# EAGLE design Servo-Steuer-Schaltung (EAGLE 6.2)
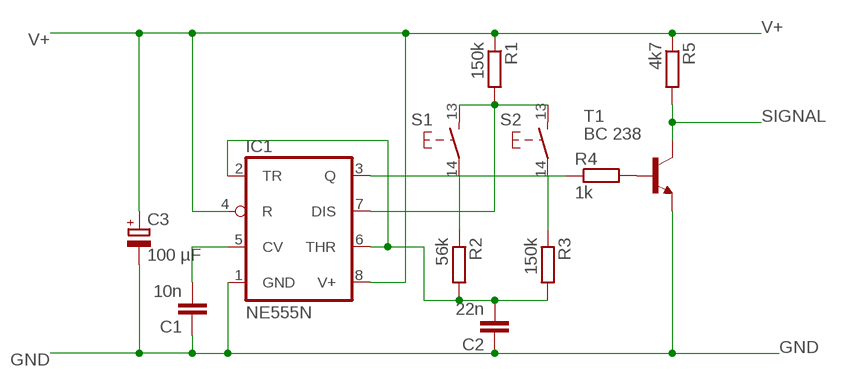
[diagram p0: schematic, sheet 1]

## Parts
C1  10n  C10/4  [C10B4]
C2  22n  C10/4  [C10B4]
C3  100 µF  CPOL-EUE2.5-7  [E2,5-7]
IC1  NE555N  [DIL08]
R1  150k  R-EU_0207/10  [0207/10]
R2  56k  R-EU_0207/10  [0207/10]
R3  150k  R-EU_0207/10  [0207/10]
R4  1k  R-EU_0207/10  [0207/10]
R5  4k7  R-EU_0207/10  [0207/10]
S1  TASTER_SCHLIESSER  [EINTASTER]
S2  TASTER_SCHLIESSER  [EINTASTER]
T1  BC 238  BC547A-NPN-TO92-CBE  [TO92-CBE]

## Nets
GND: C1.1 C2.1 C3.- IC1.1(GND) T1.E
N$1: IC1.3(Q) R4.1
N$2: R2.1 S1.14
N$3: R3.1 S2.14
N$4: C2.2 IC1.2(TR) IC1.6(THR) R2.2 R3.2
N$5: IC1.7(DIS) R1.2 S1.13 S2.13
N$6: R4.2 T1.B
N$7: C1.2 IC1.5(CV)
SIGNAL: R5.2 T1.C
V+: C3.+ IC1.4(R) IC1.8(V+) R1.1 R5.1

## Library data of the parts
C1 C2 = capacitor-wima:C: CAPACITOR naming: grid - package width
C3 = rcl:CPOL-EU: POLARIZED CAPACITOR, European symbol
IC1 = linear:*555: TIMER
R1-R5 = rcl:R-EU_: RESISTOR, European symbol
S1 S2 = e-schalter:TASTER_SCHLIESSER: Ein-Taster (Arbeitskontakt)
T1 = transistor:*-NPN-: NPN Transistror BF959 corrected 2008.03.06

## Board
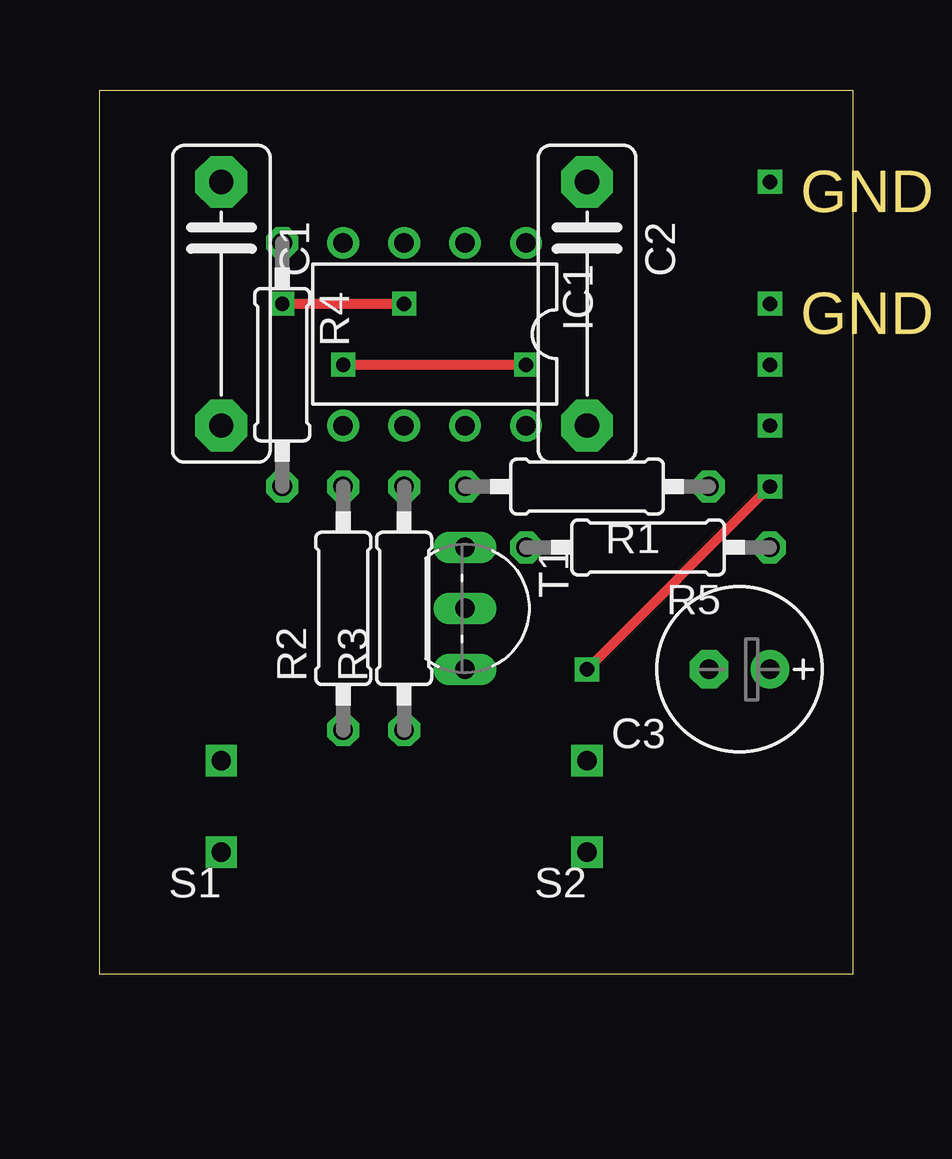
[diagram p1: board, top side]
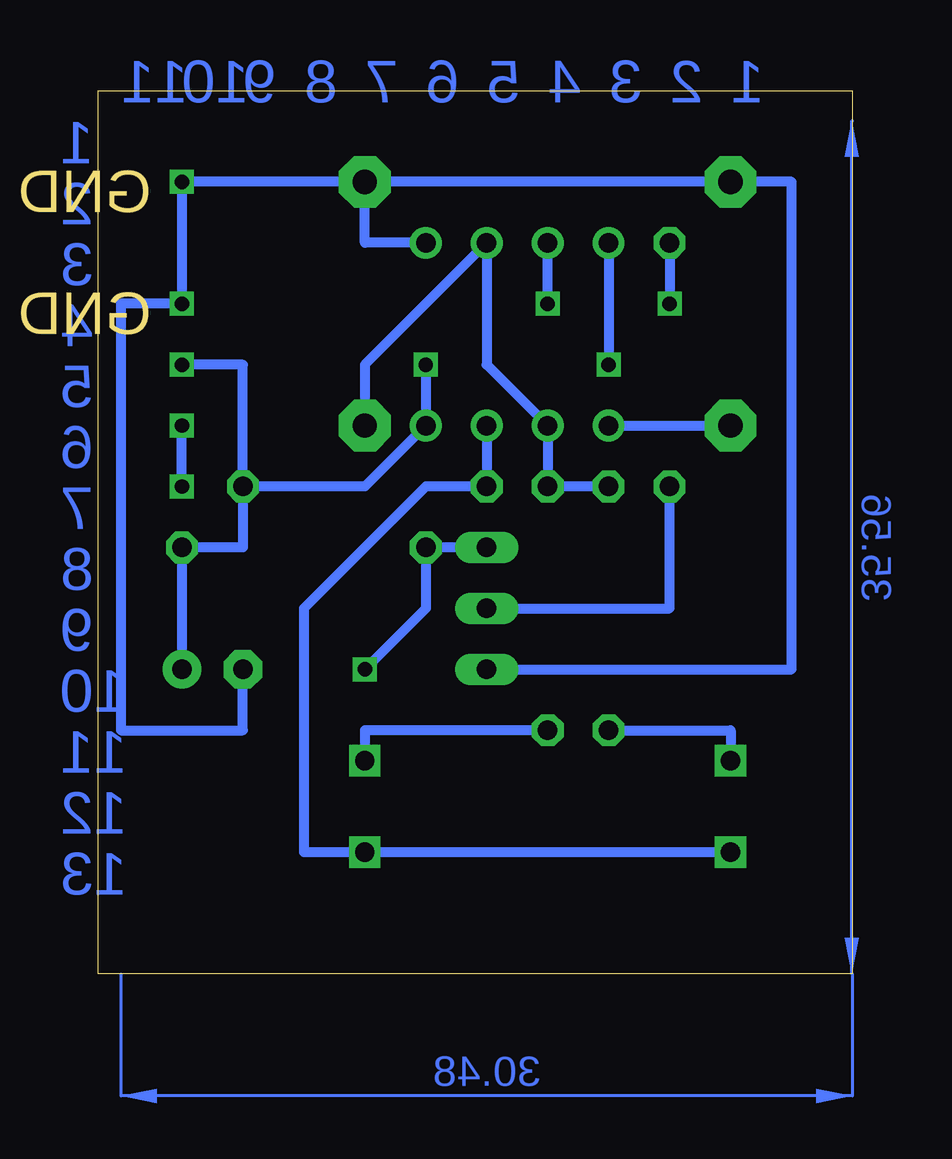
[diagram p2: board, bottom side, seen from below]

Size 31.42 x 36.82 mm. Coordinates in mm from the lower left corner, seen from the top.
Outline: 0,0 31.42,0 31.42,36.82 0,36.82 0,0
Copper layers (1*16): Top 0.035mm / dielectric 1.5mm / Bottom 0.035mm
Design rules: minimum track width 10mil, minimum drill 24mil, track to track 8mil, track to pad 8mil, pad to pad 8mil, via to via 8mil, smd to smd 8mil, copper to edge 40mil, drill to drill 8mil, minimum pad ring 10mil, minimum via ring 8mil, stop-mask expansion 4mil, vias tented up to drill 0mil, thermal gap 10mil

### Footprints (pad centres in the part's own frame; a part is rotated, then mirrored left to right if it is on the bottom)
C10B4 = drill 1.016 pad 2.159 octagon: 1 -5.08,0; 2 5.08,0
E2,5-7 = drill 0.813 pad 1.6: + -1.27,0 | drill 0.813 pad 1.6 octagon: - 1.27,0
DIL08 = drill 0.813 pad 1.27: 1 -3.81,-3.81; 2 -1.27,-3.81; 3 1.27,-3.81; 4 3.81,-3.81; 5 3.81,3.81; 6 1.27,3.81; 7 -1.27,3.81; 8 -3.81,3.81
0207/10 = drill 0.813 octagon: 1 -5.08,0; 2 5.08,0
EINTASTER = drill 0.8 square: 13 0,1.905; 14 0,-1.905
TO92-CBE = drill 0.813 long: B 0,0; C -2.54,0; E 2.54,0

### Placement (x,y rotation side)
C1  5.08,27.94 270 top
C2  20.32,27.94 270 top
C3  26.67,12.7 180 top
IC1  13.97,26.67 180 top
R1  20.32,20.32 180 top
R2  10.16,15.24 90 top
R3  12.7,15.24 90 top
R4  7.62,25.4 270 top
R5  22.86,17.78 180 top
S1  5.08,6.99 180 top
S2  20.32,6.99 180 top
T1  15.24,15.24 270 top

### Tracks (layer width: path | path; a pad name or v marks a point on that pad's centre or on a via)
GND  (via drill 0.6)
  Bottom 0.406: C2.1 v27.94,33.02 v27.94,27.94 30.48,27.94 30.48,10.16 25.4,10.16 C3.- | C2.1 C1.1 2.54,33.02 2.54,12.7 T1.E | IC1.1 20.32,30.48 C2.1
N$1  (via drill 0.6)
  Top 0.406: v7.62,27.94 v12.7,27.94
  Bottom 0.406: R4.1 v7.62,27.94 | v12.7,27.94 IC1.3
N$2
  Bottom 0.406: R2.1 5.08,10.16 S1.14
N$3
  Bottom 0.406: R3.1 20.32,10.16 S2.14
N$4
  Bottom 0.406: C2.2 20.32,25.4 IC1.2 15.24,25.4 IC1.6 R3.2 R2.2
N$5
  Bottom 0.406: S1.13 S2.13 22.86,5.08 22.86,15.24 17.78,20.32 R1.2 IC1.7
N$6
  Bottom 0.406: T1.B 7.62,15.24 R4.2
N$7
  Bottom 0.406: IC1.5 C1.2
SIGNAL  (via drill 0.6)
  Top 0.406: v20.32,12.7 v27.94,20.32
  Bottom 0.406: T1.C R5.2 17.78,15.24 v20.32,12.7 | v27.94,20.32 v27.94,22.86
V+  (via drill 0.6)
  Top 0.406: v10.16,25.4 v17.78,25.4
  Bottom 0.406: IC1.4 v10.16,25.4 | v17.78,25.4 IC1.8 20.32,20.32 R1.1 | C3.+ R5.1 25.4,17.78 R1.1 | R1.1 25.4,25.4 v27.94,25.4
  other vias: 27.94,12.7
(copper drawn outside any net)
  shapes: Bottom area x2

### Text on the board
Bottom: 1 | 2 | 3 | 4 | 5 | 6 | 7 | 8 | 9 | 10 | 11 | 1 | 2 | 3 | 4 | 5 | 6 | 7 | 8 | 9 | 10 | 11 | 12 | 13
Pads: V+ | Signal | V+
Dimension: GND | GND